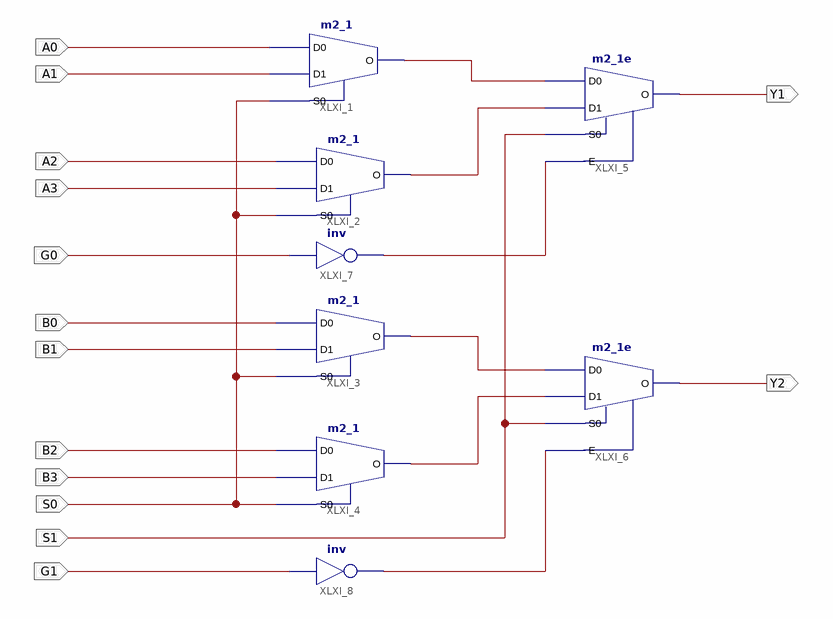
[diagram p0: schematic sheet 1]
// Xilinx ISE schematic X74_153.sch (spartan3e) as structural Verilog: 8 symbols, 14 ports
module X74_153 (
  input  A0,
  input  A1,
  input  A2,
  input  A3,
  input  G0,
  input  B0,
  input  B1,
  input  B2,
  input  B3,
  input  G1,
  input  S0,
  input  S1,
  output Y1,
  output Y2
);

  wire XLXN_1, XLXN_2, XLXN_13, XLXN_14, XLXN_15, XLXN_22;

  m2_1 XLXI_1 (.D0(A0), .D1(A1), .S0(S0), .O(XLXN_1));
  m2_1 XLXI_2 (.D0(A2), .D1(A3), .S0(S0), .O(XLXN_2));
  m2_1 XLXI_3 (.D0(B0), .D1(B1), .S0(S0), .O(XLXN_13));
  m2_1 XLXI_4 (.D0(B2), .D1(B3), .S0(S0), .O(XLXN_14));
  m2_1e XLXI_5 (.D0(XLXN_1), .D1(XLXN_2), .E(XLXN_22), .S0(S1), .O(Y1));
  m2_1e XLXI_6 (.D0(XLXN_13), .D1(XLXN_14), .E(XLXN_15), .S0(S1), .O(Y2));
  not XLXI_7 (XLXN_22, G0);
  not XLXI_8 (XLXN_15, G1);
endmodule
